# Altium schematic sheet Microcontroller Schematic.SchDoc
size A; SheetNumber: 1; SheetTotal: 3
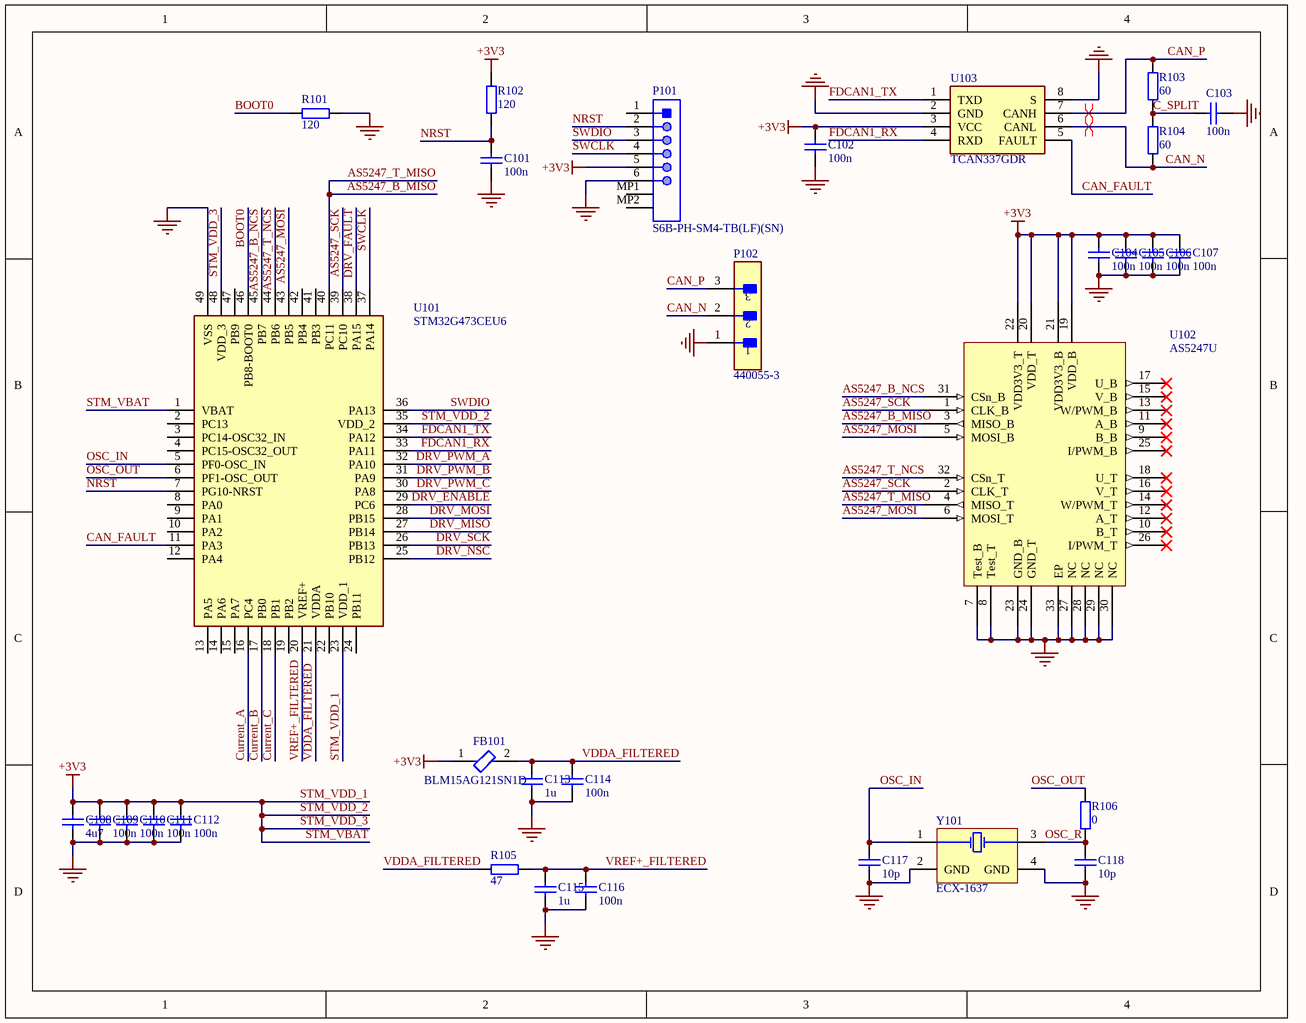
[diagram p0: Microcontroller Schematic.SchDoc]

## Parts
C101  100n  [CAPC1005X55N]
C102  100n  [CAPC1005X55N]
C103  100n  [CAPC1005X55N]
C104  100n  [CAPC1005X55N]
C105  100n  [CAPC1005X55N]
C106  100n  [CAPC1005X55N]
C107  100n  [CAPC1005X55N]
C108  4u7  [CAPC1608X90N]
C109  100n  [CAPC1005X55N]
C110  100n  [CAPC1005X55N]
C111  100n  [CAPC1005X55N]
C112  100n  [CAPC1005X55N]
C113  1u  [CAPC1005X55N]
C114  100n  [CAPC1005X55N]
C115  1u  [CAPC1005X55N]
C116  100n  [CAPC1005X55N]
C117  10p  [CAPC1005X55N]
C118  10p  [CAPC1005X55N]
FB101  BLM15AG121SN1D  [FP-BLM15-0_05-MFG]
P101  S6B-PH-SM4-TB(LF)(SN)  [JST-S6B-PH-SM4-TB(LF)(SN)_V]
P102  440055-3  [FP-440055-3-MFG]
R101  120  [RESC1005X40N]
R102  120  [RESC1005X40N]
R103  60  [RESC1005X40N]
R104  60  [RESC1005X40N]
R105  47  [RESC1005X40N]
R106  0  [RESC1005X40N]
U101  STM32G473CEU6  [QFN50P700X700X65-49N-D]
U102  AS5247U  [QFN-N32-THM]
U103  TCAN337GDR  [SOIC127P600X175-8N]
Y101  ECX-1637  [ECX-1637]

## Nets
GND: C101.2 C102.1 C103.2 C104.1 C105.1 C106.1 C107.1 C108.2 C109.1 C110.1 C111.1 C112.1 C113.1 C114.1 C115.1 C116.1 C117.1 C118.1 P101.6 P102.1 R101.2 U101.49(VSS) U102.7(Test_B) U102.8(Test_T) U102.23(GND_B) U102.24(GND_T) U102.27(NC) U102.28(NC) U102.29(NC) U102.30(NC) U102.33(EP) U103.2(GND) U103.8(S) Y101.2(GND) Y101.4(GND)
STM_VBAT: C102.2 C104.2 C105.2 C106.2 C107.2 C108.1 C109.2 C110.2 C111.2 C112.2 FB101.1 P101.5 R102.1 U101.1(VBAT) U101.23(VDD_1) U101.35(VDD_2) U101.48(VDD_3) U102.19(VDD_B) U102.20(VDD_T) U102.21(VDD3V3_B) U102.22(VDD3V3_T) U103.3(VCC)  [also labelled +3V3, STM_VDD_1, STM_VDD_2, STM_VDD_3]
AS5247_B_MISO: U101.40(PC11) U102.3(MISO_B) U102.4(MISO_T)  [also labelled AS5247_T_MISO]
AS5247_B_NCS: U101.45(PB7) U102.31(CSn_B)
AS5247_MOSI: U101.43(PB5) U102.5(MOSI_B) U102.6(MOSI_T)
AS5247_SCK: U101.39(PC10) U102.1(CLK_B) U102.2(CLK_T)
AS5247_T_NCS: U101.44(PB6) U102.32(CSn_T)
BOOT0: R101.1 U101.46(PB8-BOOT0)
C_SPLIT: C103.1 R103.1 R104.2
CAN_FAULT: U101.11(PA3) U103.5(FAULT)
CAN_N: P102.2 R104.1 U103.6(CANL)
CAN_P: P102.3 R103.2 U103.7(CANH)
Current_A: U101.16(PC4)
Current_B: U101.17(PB0)
Current_C: U101.18(PB1)
DRV_ENABLE: U101.29(PC6)
DRV_FAULT: U101.38(PA15)
DRV_MISO: U101.27(PB14)
DRV_MOSI: U101.28(PB15)
DRV_NSC: U101.25(PB12)
DRV_PWM_A: U101.32(PA10)
DRV_PWM_B: U101.31(PA9)
DRV_PWM_C: U101.30(PA8)
DRV_SCK: U101.26(PB13)
FDCAN1_RX: U101.33(PA11) U103.4(RXD)
FDCAN1_TX: U101.34(PA12) U103.1(TXD)
NRST: C101.1 P101.2 R102.2 U101.7(PG10-NRST)
OSC_IN: C117.2 U101.5(PF0-OSC_IN) Y101.1(X1)
OSC_OUT: R106.1 U101.6(PF1-OSC_OUT)
OSC_R: C118.2 R106.2 Y101.3(X2)
SWCLK: P101.4 U101.37(PA14)
SWDIO: P101.3 U101.36(PA13)
VDDA_FILTERED: C113.2 C114.2 FB101.2 R105.1 U101.21(VDDA)
VREF+_FILTERED: C115.2 C116.2 R105.2 U101.20(VREF+)

Not connected (* = marked no-connect by the designer): P101 1 MP1 MP2; U101 2(PC13) 3(PC14-OSC32_IN) 4(PC15-OSC32_OUT) 8(PA0) 9(PA1) 10(PA2) 12(PA4) 13(PA5) 14(PA6) 15(PA7) 19(PB2) 22(PB10) 24(PB11) 41(PB3) 42(PB4) 47(PB9); U102 9(B_B)* 10(B_T)* 11(A_B)* 12(A_T)* 13(W/PWM_B)* 14(W/PWM_T)* 15(V_B)* 16(V_T)* 17(U_B)* 18(U_T)* 25(I/PWM_B)* 26(I/PWM_T)*

## Layout directives
differential pair: CAN_N, CAN_P

## Library data of the parts
C101-C107 C109-C118 = CAP_0402_16V: Capacitor; Manufacturer_Name: Samsung Electro-Mechanics; Manufacturer_Part_Number: CL05B104KO5NNNC; Datasheet Link: https://datasheet.datasheetarchive.com/originals/distributors/Datasheets-DGA10/2408147.pdf; Height: 0.55mm; Mouser Part Number: 187-CL05B104KO5NNNC; Mouser Price/Stock: https://www.mouser.co.uk/ProductDetail/Samsung-Electro-Mechanics/CL05B104KO5NNNC?qs=hqM3L16%252BxlfT2SKOuAUq6Q%3D%3D; Arrow Part Number: CL05B104KO5NNNC; Arrow Price/Stock: https://www.arrow.com/en/products/cl05b104ko5nnnc/samsung-electro-mechanics
C108 = CAP_0603_16V: Capacitor; Manufacturer_Name: Samsung Electro-Mechanics; Manufacturer_Part_Number: CL05B104KO5NNNC; Datasheet Link: https://datasheet.datasheetarchive.com/originals/distributors/Datasheets-DGA10/2408147.pdf; Height: 0.55mm; Mouser Part Number: 187-CL05B104KO5NNNC; Mouser Price/Stock: https://www.mouser.co.uk/ProductDetail/Samsung-Electro-Mechanics/CL05B104KO5NNNC?qs=hqM3L16%252BxlfT2SKOuAUq6Q%3D%3D; Arrow Part Number: CL05B104KO5NNNC; Arrow Price/Stock: https://www.arrow.com/en/products/cl05b104ko5nnnc/samsung-electro-mechanics
FB101 = CMP-0686-00170-4: Chip Ferrite Bead, 0402, 120Ω @ 100MHz, 0.19Ω, 25%, 550mA; Material: Steel; Max DC Current: 500mA; Shielding: Unshielded; Number of Lines: 1; DC Resistance (DCR): 190mR; Impedance: 120R; Packaging: Tape and Reel; Core Material: Ferrite; Number of Pins: 2; Tolerance: 25%; Case Code (Imperial): 0402; DC Current: 500mA; Termination: SMD/SMT; Height: 0.5mm; REACH SVHC: No SVHC; Max Operating Temperature: 125°C; Case Code (Metric): 1005; Length: 1mm; Test Frequency: 100MHz; Lead Free: Lead Free; Depth: 0.55mm; Max Current Rating: 550mA; Case/Package: 0402; Min Operating Temperature: -55°C; Width: 0.5mm; Military Standard: Not; Frequency: 100MHz; Current Rating: 550mA; Package Quantity: 1; Number of Circuits: 1; Radiation Hardening: No
P101 = CMP-2000-07027-1: Male Header, Pitch 2 mm, 1 x 6 Position, Height 5.5 mm, -25 to 85 degC; Manufacturer: JST; Pitch: 2mm; Style/Orientation: RightAngleHeader/Plug; No of Positions: 6; Package Reference: S6B-PH-SM4-TB(LF)(SN); Type: ShroudedHeader; Package Description: Male Header, Pitch 2 mm, 1 x 6 Position, Height 5.5 mm; Mounting Technology: SurfaceMount; Datasheet Version: 11/2008; Termination: Solder; Datasheet URL: https://datasheet.ciiva.com/11747/0900766b80df0d9d-11747278.pdf; Manufacturer URL: http://www.jst.com/home2.html
P102 = CMP-03369-000061-1: CONN HEADER R/A 3POS 2MM; Manufacturer: TE Connectivity; Voltage Rating: 250V; Conn Orientation: Right Angle; Current Rating: 3A; Number Of Contacts: 3; Conn Gender: Male; Height: 5.25mm; Automotive: No; Manufacturer Part Number: 440055-3; Temperature: -25°C to +85°C; Pitch: 2mm; Category: Conn; Device Class L1: Connectors; ComponentLink2Description: Datasheet; Footprint Url: https://www.te.com/commerce/DocumentDelivery/DDEController?Action=showdoc&DocId=Customer+Drawing%7F440055%7FB4%7Fpdf%7FEnglish%7FENG_CD_440055_B4.pdf%7F440055-3; Package: 440055-3; ComponentLink2URL: https://www.te.com/usa-en/product-440055-3.datasheet.pdf; Number Of Rows: 1; Octopart: https://octopart.com/440055-3-te+connectivity-40644627; Mouser Description: Headers & Wire Housings 3 POS HDR R/A 2.0mm; Digikey Description: CONN HEADER R/A 3POS 2MM; Device Class L2: Headers and Wire Housings; Lead Free: Yes; Temperature Range High: +85°C; RoHS: TRUE; Temperature Range Low: -25°C; Contact Material: Tin; Device Class L3: unset
R101-R106 = RES_0402
U101 = STM32G473CEU6: Integrated Circuit; Manufacturer_Name: STMicroelectronics; Datasheet Link: https://www.st.com/resource/en/datasheet/stm32g473cb.pdf; Height: 0.65mm; Manufacturer_Part_Number: STM32G473CEU6; Mouser Part Number: 511-STM32G473CEU6; Mouser Price/Stock: https://www.mouser.co.uk/ProductDetail/STMicroelectronics/STM32G473CEU6?qs=uwxL4vQweFNR9dwvFWWm2Q%3D%3D; Arrow Part Number: STM32G473CEU6; Arrow Price/Stock: https://www.arrow.com/en/products/stm32g473ceu6/stmicroelectronics
U102 = AS5247U: ams AS5247U Magnetic Rotary Position Sensor; ComponentLink1Description: New link; ComponentLink1URL: *; ComponentLink2Description: New link 1; ComponentLink2URL: *
U103 = TCAN337GDR: Integrated Circuit; Manufacturer_Name: Texas Instruments; Datasheet Link: http://www.ti.com/lit/gpn/tcan337g; Height: 1.75mm; Manufacturer_Part_Number: TCAN337GDR; Mouser Part Number: 595-TCAN337GDR; Mouser Price/Stock: https://www.mouser.co.uk/ProductDetail/Texas-Instruments/TCAN337GDR?qs=gMfM3zrbS4qJ%252BEWbPaeUtA%3D%3D; Arrow Part Number: TCAN337GDR; Arrow Price/Stock: https://www.arrow.com/en/products/tcan337gdr/texas-instruments?region=nac